# EAGLE design freeduino_V1.12 (EAGLE 4.16)
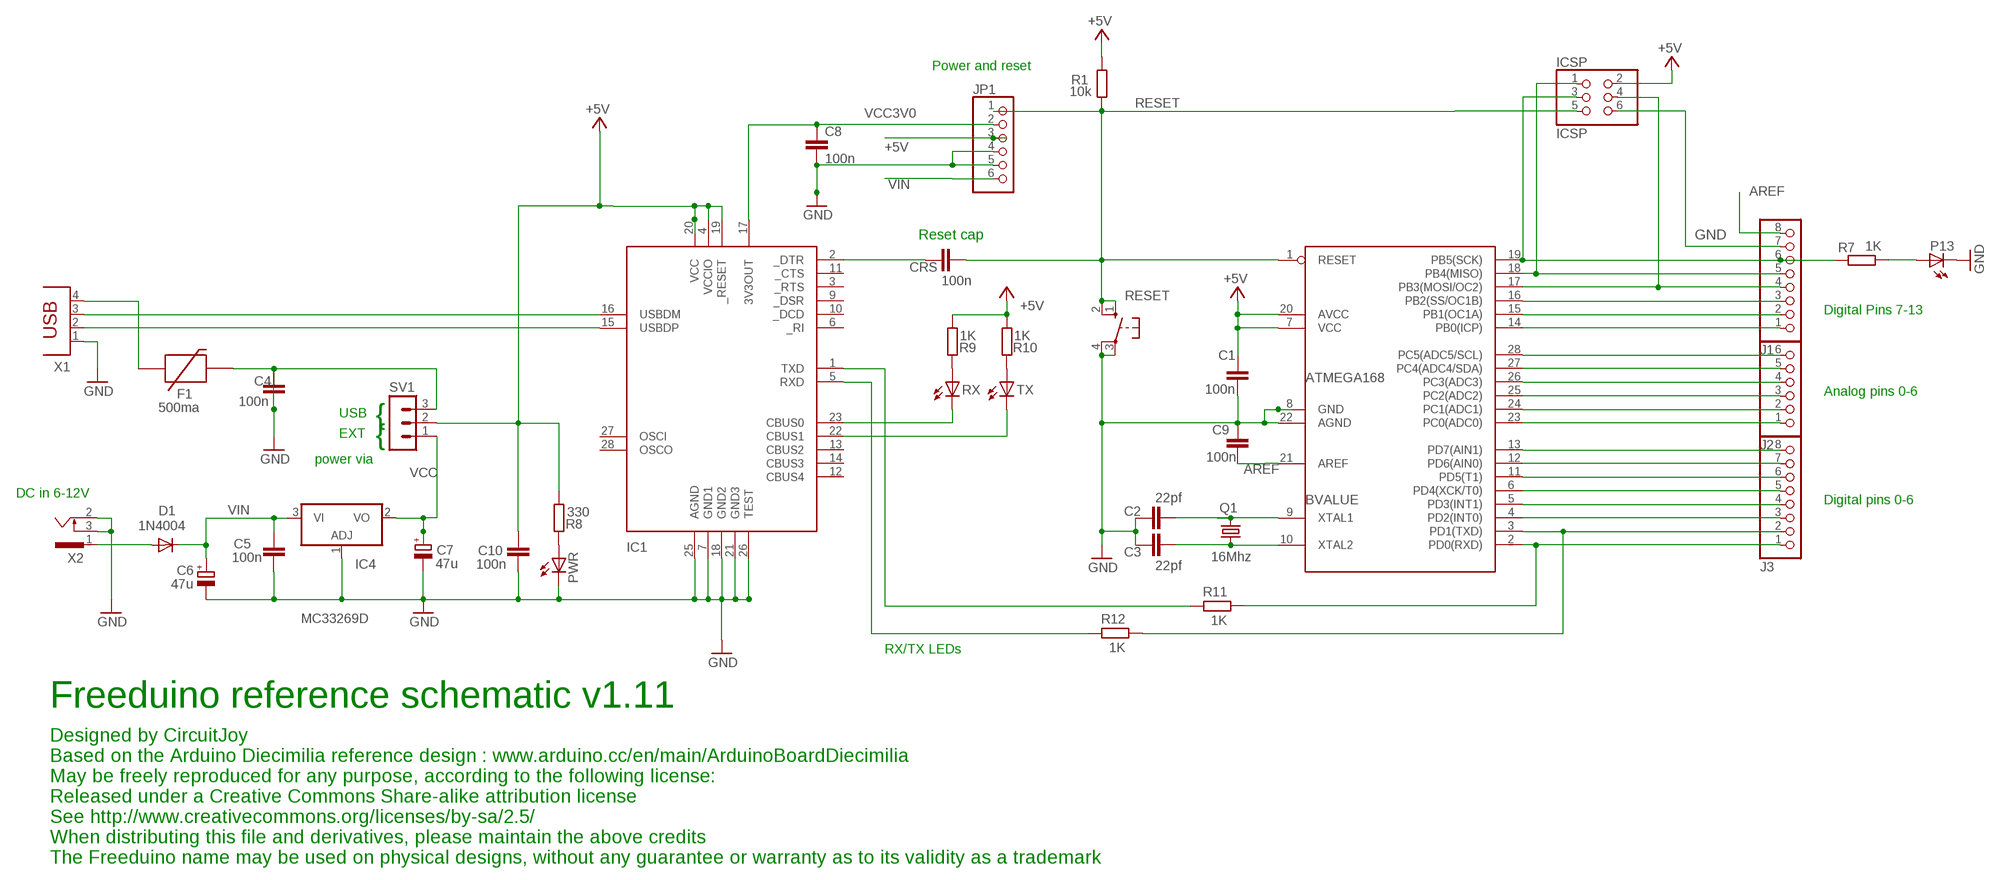
[diagram p0: schematic, sheet 1]

## Parts
BVALUE  ATMEGA168  MEGA8-P  [DIL28-3]
C1  100n  C-EUC0603  [C0603]
C2  22pf  C-EUC0603  [C0603]
C3  22pf  C-EUC0603  [C0603]
C4  100n  C-EUC0603  [C0603]
C5  100n  C-EUC0603  [C0603]
C6  47u  CPOL-EUD  [PANASONIC_D]
C7  47u  CPOL-EUD  [PANASONIC_D]
C8  100n  C-EUC0603  [C0603]
C9  100n  C-EUC0603  [C0603]
C10  100n  C-EUC0603  [C0603]
CRS  100n  C-EUC0603  [C0603]
D1  1N4004  DIODESMA  [SMA-DIODE]
F1  500ma  PTCPTH  [PTC]
IC1  FT232RL  FT232RL-PINNED  [SSOP28DB]
IC4  MC33269D  [DPACK]
ICSP  ICSP  PINHD-2X3  [2X03]
J1  PINHD-1X8  [1X08]
J2  PINHD-1X6  [1X06]
J3  PINHD-1X8  [1X08]
JP1  PINHD-1X6  [1X06]
P13  LEDCHIPLED_0603  [CHIPLED_0603]
PWR  LEDCHIPLED_0603  [CHIPLED_0603]
Q1  16Mhz  CRYSTALHC49U-V  [HC49U-V]
R1  10k  R-EU_R0603  [R0603]
R7  1K  R-EU_R0603  [R0603]
R8  330  R-EU_R0603  [R0603]
R9  1K  R-EU_R0603  [R0603]
R10  1K  R-EU_R0603  [R0603]
R11  1K  R-EU_R0603  [R0603]
R12  1K  R-EU_R0603  [R0603]
RESET  10-XX  [B3F-10XX]
RX  LEDCHIPLED_0603  [CHIPLED_0603]
SV1  MA03-1  [MA03-1]
TX  LEDCHIPLED_0603  [CHIPLED_0603]
X1  PN61729  [PN61729]
X2  SCD-014A  [SCD-014-A]

## Nets
+5V [power]: BVALUE.7(VCC) BVALUE.20(AVCC) C1.1 C10.2 IC1.4(VCCIO) IC1.19(_RESET) IC1.20(VCC) ICSP.2 JP1.3 R1.2 R8.1 R9.1 R10.1 SV1.2
AREF: BVALUE.21(AREF) C9.1 J1.8
GND [power]: BVALUE.8(GND) BVALUE.22(AGND) C1.2 C2.1 C3.1 C4.1 C4.2 C5.1 C6.- C7.- C8.2 C9.2 C10.1 F1.P$2 IC1.7(GND1) IC1.18(GND2) IC1.21(GND3) IC1.25(AGND) IC1.26(TEST) IC4.1(ADJ) ICSP.6 J1.7 JP1.4 JP1.5 P13.C PWR.C RESET.3(P) RESET.4(P1) SV1.3 X1.1 X2.2 X2.3
M8RXD: IC1.1(TXD) R11.1
M8TXD: IC1.5(RXD) R12.1
N$2: BVALUE.15(PB1(OC1A)) J1.2
N$3: PWR.A R8.2
N$5: IC1.23(CBUS0) RX.C
N$6: BVALUE.9(XTAL1) C2.2 Q1.2
N$8 [power]: D1.A X2.1
N$9: IC1.16(USBDM) X1.3
N$10: BVALUE.4(PD2(INT0)) J3.3
N$11: BVALUE.5(PD3(INT1)) J3.4
N$12: BVALUE.6(PD4(XCK/T0)) J3.5
N$13: BVALUE.11(PD5(T1)) J3.6
N$14: BVALUE.12(PD6(AIN0)) J3.7
N$15: BVALUE.13(PD7(AIN1)) J3.8
N$16: BVALUE.23(PC0(ADC0)) J2.1
N$17: BVALUE.24(PC1(ADC1)) J2.2
N$18: BVALUE.25(PC2(ADC2)) J2.3
N$19: BVALUE.26(PC3(ADC3)) J2.4
N$20: BVALUE.27(PC4(ADC4/SDA)) J2.5
N$21: BVALUE.28(PC5(ADC5/SCL)) J2.6
N$22: BVALUE.3(PD1(TXD)) J3.2 R12.2
N$23: BVALUE.16(PB2(SS/OC1B)) J1.3
N$24: IC1.15(USBDP) X1.2
N$26: BVALUE.18(PB4(MISO)) ICSP.1 J1.5
N$27: F1.P$1 X1.4
N$28: BVALUE.14(PB0(ICP)) J1.1
N$29: IC1.22(CBUS1) TX.C
N$31: BVALUE.10(XTAL2) C3.2 Q1.1
N$32: P13.A R7.1
N$34: R10.2 TX.A
N$36: R9.2 RX.A
N$37: CRS.1 IC1.2(_DTR)
N$43: BVALUE.17(PB3(MOSI/OC2)) ICSP.4 J1.4
N$44: BVALUE.2(PD0(RXD)) J3.1 R11.2
RESET: BVALUE.1(RESET) CRS.2 ICSP.5 JP1.1 R1.1 RESET.1(S) RESET.2(S1)
SCK: BVALUE.19(PB5(SCK)) ICSP.3 J1.6 R7.2
VCC: C7.+ IC4.2(VO) SV1.1
VCC3V0: C8.1 IC1.17(3V3OUT) JP1.2
VIN [power]: C5.2 C6.+ D1.C IC4.3(VI) JP1.6
Unconnected: IC1.3(_RTS) IC1.6(_RI) IC1.9(_DSR) IC1.10(_DCD) IC1.11(_CTS) IC1.12(CBUS4) IC1.13(CBUS2) IC1.14(CBUS3) IC1.27(OSCI) IC1.28(OSCO)

## Notes on the sheet
- Power and reset
- Reset cap
- Digital Pins 7-13
- Analog pins 0-6
- USB
- {
- EXT
- {
- power via
- DC in 6-12V
- Digital pins 0-6
- RX/TX LEDs
- Freeduino reference schematic v1.11
- Designed by CircuitJoy
- Based on the Arduino Diecimilia reference design : www.arduino.cc/en/main/ArduinoBoardDiecimilia
- May be freely reproduced for any purpose, according to the following license:
- Released under a Creative Commons Share-alike attribution license
- See http://www.creativecommons.org/licenses/by-sa/2.5/
- When distributing this file and derivatives, please maintain the above credits
- The Freeduino name may be used on physical designs, without any guarantee or warranty as to its validity as a trademark

## Library data of the parts
BVALUE = my-library:MEGA8-P: MICROCONTROLLER 8 Kbytes FLASH 1 kbytes SRAM 512 bytes EEPROM USART 4-channel 10 bit ADC 2-channel 8 bit ADC Source: avr.lbr
C1-C5 C8-C10 CRS = rcl:C-EU: CAPACITOR, European symbol
C6 C7 = rcl:CPOL-EU: POLARIZED CAPACITOR, European symbol
D1 = SparkFunEagle-6-6-07:DIODE: Diode These are standard reverse protection diodes and small signal diodes. SMA package can handle up to about 1A. SOD-323 can handle about 200mA. What the SOD-323 package when ordering, there are some mfgs out there that are 5-pin packages.
F1 = SparkFunEagle-6-6-07:PTC: Resettable Fuse PTC Resettable Fuse. Spark Fun Electronics SKU : COM-08357
IC1 = my-library:FT232RL-PINNED: USB UART FT232RL 4th Generation USB UART (USB <-> Serial) Controller. Spark Fun Electronics SKU : COM-00650
IC4 = linear:MC33269?*: Adjustable Output Low Dropout Voltage Regulator 800 mA Source: http://www.onsemi.com/pub/Collateral/MC33269-D.PDF
ICSP = pinhead:PINHD-2X3: PIN HEADER
J1 J3 = pinhead:PINHD-1X8: PIN HEADER
J2 JP1 = pinhead:PINHD-1X6: PIN HEADER
P13 PWR RX TX = led:LED: LED OSRAM: - CHIPLED LG R971, LG N971, LY N971, LG Q971, LY Q971, LO R971, LY R971 LH N974, LH R974 LS Q976, LO Q976, LY Q976 LO Q996 - Hyper CHIPLED LW Q18S LB Q993, LB Q99A, LB R99A - SideLED LS A670, LO A670, LY A670, LG A670, LP A670 LB A673, LV A673, LT A673, LW A673 LH A674 LY A675 LS A676, LA A676, LO A676, LY A676, LW A676 LS A679, LY A679, LG A679 - Hyper Micro SIDELED® LS Y876, LA Y876, LO Y876, LY Y876 LT Y87S - SmartLED LW L88C, LW L88S LB L89C, LB L89S, LG L890 LS L89K, LO L89K, LY L89K LS L896, LA L896, LO L896, LY L896 - TOPLED LS T670, LO T670, LY T670, LG T670, LP T670 LSG T670, LSP T670, LSY T670, LOP T670, LYG T670 LG T671, LOG T671, LSG T671 LB T673, LV T673, LT T673, LW T673 LH T674 LS T676, LA T676, LO T676, LY T676, LB T676, LH T676, LSB T676, LW T676 LB T67C, LV T67C, LT T67C, LS T67K, LO T67K, LY T67K, LW E67C LS E67B, LA E67B, LO E67B, LY E67B, LB E67C, LV E67C, LT E67C LW T67C LS T679, LY T679, LG T679 LS T770, LO T770, LY T770, LG T770, LP T770 LB T773, LV T773, LT T773, LW T773 LH T774 LS E675, LA E675, LY E675, LS T675 LS T776, LA T776, LO T776, LY T776, LB T776 LHGB T686 LT T68C, LB T68C - Hyper Mini TOPLED® LB M676 - Mini TOPLED Santana® LG M470 LS M47K, LO M47K, LY M47K Source: http://www.osram.convergy.de/
Q1 = crystal:CRYSTAL: CRYSTAL
R1 R7-R12 = rcl:R-EU_: RESISTOR, European symbol
RESET = switch-omron:10-XX: OMRON SWITCH
SV1 = con-lstb:MA03-1: PIN HEADER
X1 = con-berg:PN61729: BERG USB connector
X2 = con-shiua-chyuan:SCD-014A: Power Jack 2.5mm

## Net classes
1 power: width 0.61 mm

## Board
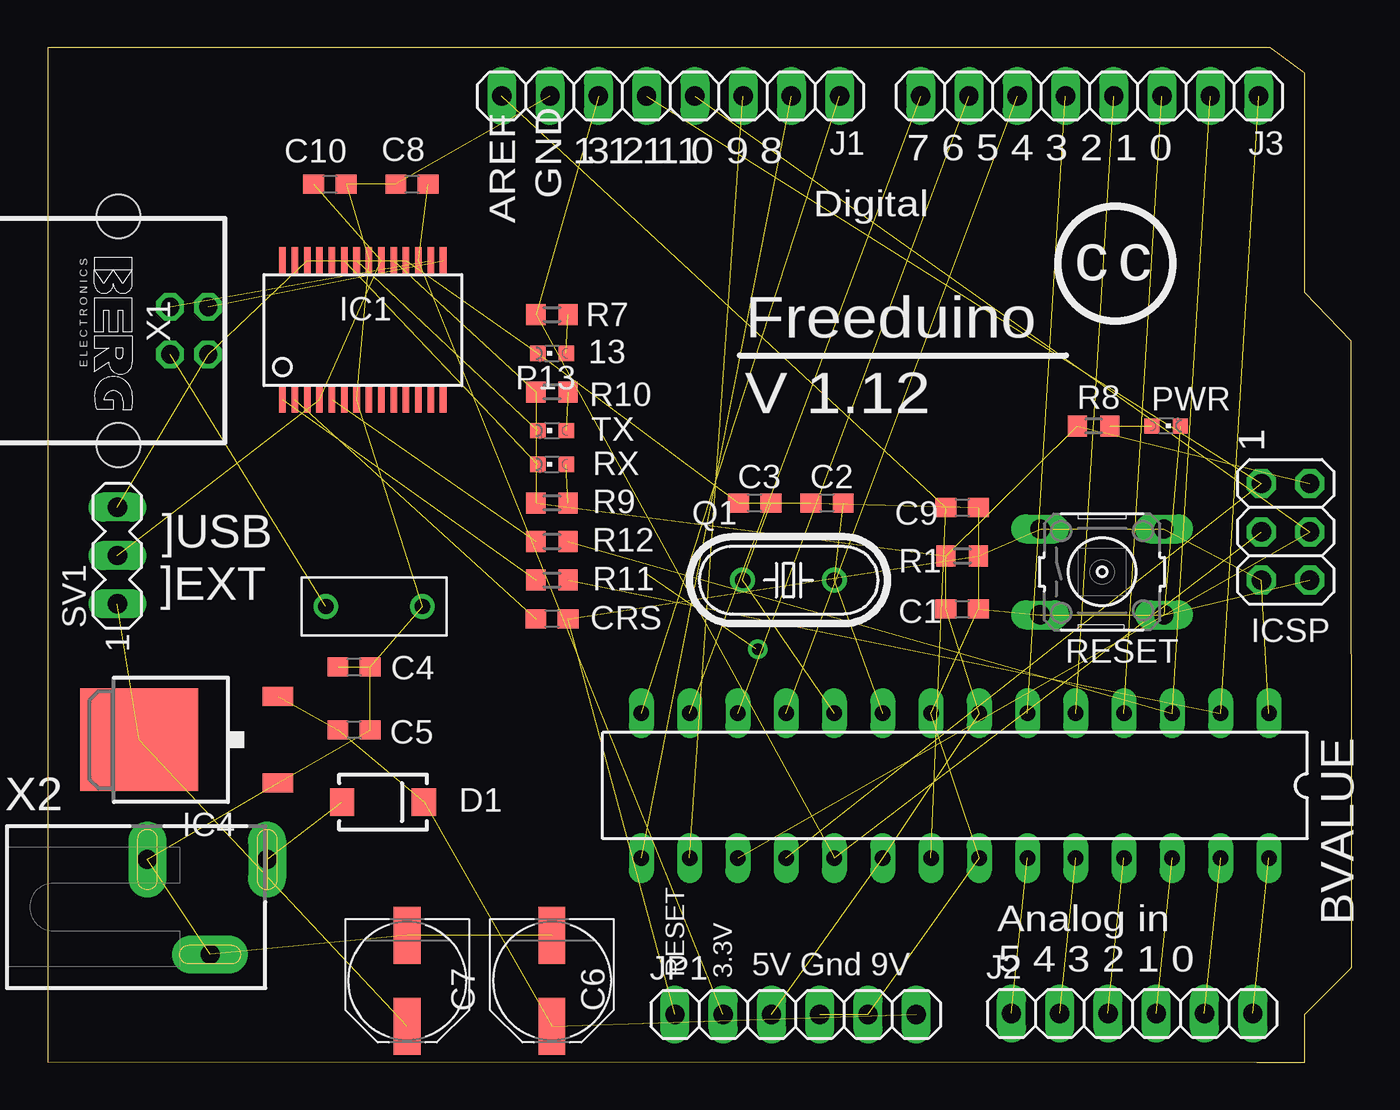
[diagram p1: board, top side]

Size 68.65 x 53.41 mm. Coordinates in mm from the lower left corner, seen from the top.
Outline: 0,53.41 0,0.01 63.63,0 66.16,0 66.17,0.03 66.17,2.51 68.65,5.01 68.62,37.96 66.17,40.5 66.17,52.06 64.34,53.4 0,53.41
Copper layers (1*16): Top 0.035mm / dielectric 1.5mm / Bottom 0.035mm
Design rules "default": minimum track width 10mil, minimum drill 24mil, track to track 8mil, track to pad 8mil, pad to pad 8mil, via to via 8mil, smd to smd 8mil, copper to edge 40mil, drill to drill 8mil, minimum pad ring 10mil, minimum via ring 8mil, stop-mask expansion 4mil, vias tented up to drill 0mil, thermal gap 10mil

### Footprints (pad centres in the part's own frame; a part is rotated, then mirrored left to right if it is on the bottom)
DIL28-3 = drill 0.813 long: 1 -16.51,-3.81; 2 -13.97,-3.81; 3 -11.43,-3.81; 4 -8.89,-3.81; 5 -6.35,-3.81; 6 -3.81,-3.81; 7 -1.27,-3.81; 8 1.27,-3.81; 9 3.81,-3.81; 10 6.35,-3.81; 11 8.89,-3.81; 12 11.43,-3.81; 13 13.97,-3.81; 14 16.51,-3.81; 15 16.51,3.81; 16 13.97,3.81; 17 11.43,3.81; 18 8.89,3.81; 19 6.35,3.81; 20 3.81,3.81; 21 1.27,3.81; 22 -1.27,3.81; 23 -3.81,3.81; 24 -6.35,3.81; 25 -8.89,3.81; 26 -11.43,3.81; 27 -13.97,3.81; 28 -16.51,3.81
C0603 = smd 1.1 x 1: 1 -0.85,0; 2 0.85,0
PANASONIC_D = smd 3 x 1.4: + 2.4,0; - -2.4,0
SMA-DIODE = smd 1.27 x 1.47: A -2.15,0; C 2.15,0
PTC = drill 0.8 round: P$1 -2.54,0; P$2 2.54,0
SSOP28DB = smd 0.348 x 1.397: 1 -4.225,-3.656; 2 -3.575,-3.656; 3 -2.925,-3.656; 4 -2.275,-3.656; 5 -1.625,-3.656; 6 -0.975,-3.656; 7 -0.325,-3.656; 8 0.325,-3.656; 9 0.975,-3.656; 10 1.625,-3.656; 11 2.275,-3.656; 12 2.925,-3.656; 13 3.575,-3.656; 14 4.225,-3.656; 15 4.225,3.656; 16 3.575,3.656; 17 2.925,3.656; 18 2.275,3.656; 19 1.625,3.656; 20 0.975,3.656; 21 0.325,3.656; 22 -0.325,3.656; 23 -0.975,3.656; 24 -1.625,3.656; 25 -2.275,3.656; 26 -2.925,3.656; 27 -3.575,3.656; 28 -4.225,3.656
DPACK = smd 1 x 1.6: 1 -2.28,-4.8; 3 2.28,-4.8 | smd 5.4 x 6.2: 2 0,2.5
2X03 = drill 1.016 octagon: 1 -2.54,-1.27; 2 -2.54,1.27; 3 0,-1.27; 4 0,1.27; 5 2.54,-1.27; 6 2.54,1.27
1X08 = drill 1.016 long: 1 -8.89,0; 2 -6.35,0; 3 -3.81,0; 4 -1.27,0; 5 1.27,0; 6 3.81,0; 7 6.35,0; 8 8.89,0
1X06 = drill 1.016 long: 1 -6.35,0; 2 -3.81,0; 3 -1.27,0; 4 1.27,0; 5 3.81,0; 6 6.35,0
CHIPLED_0603 = smd 0.8 x 0.8: A 0,-0.75; C 0,0.75
HC49U-V = drill 0.813 round: 1 -2.413,0; 2 2.413,0
R0603 = smd 1 x 1.1: 1 -0.85,0; 2 0.85,0
B3F-10XX = drill 1.016 long: 1 -3.251,2.261; 2 3.251,2.261; 3 -3.251,-2.261; 4 3.251,-2.261
MA03-1 = drill 1.016 long: 1 -2.54,0; 2 0,0; 3 2.54,0
PN61729 = drill 0.95 octagon: 1 1.25,4.71; 2 -1.25,4.71; 3 -1.25,2.71; 4 1.25,2.71 | hole 2.3: -6.02,0; 6.02,0
SCD-014-A = drill 1 pad 2 long: 1 -2.5,13.8; 2 -2.5,7.5; 3 2.5,10.8

### Placement (x,y rotation side)
BVALUE  47.76,14.56 180 top
C1  48.14,23.85 0 top
C2  41.02,29.44 0 top
C3  37.21,29.44 0 top
C4  16.13,20.8 180 top
C5  16.13,17.5 180 top
C6  26.55,4.29 270 top
C7  18.93,4.29 270 top
C8  19.18,46.2 180 top
C9  48.14,29.18 0 top
C10  14.86,46.2 180 top
CRS  26.55,23.34 0 top
D1  17.66,13.69 0 top
F1  17.19,23.99 0 top
IC1  16.59,38.54 0 top
IC4  7.33,16.97 90 top
ICSP  65.15,27.91 270 top
J1  32.79,50.85 180 top
J2  57.08,2.57 0 top
J3  54.84,50.85 180 top
JP1  39.37,2.51 0 top
P13  26.55,37.31 90 top
PWR  58.86,33.49 270 top
Q1  38.99,25.37 0 top
R1  48.14,26.64 180 top
R7  26.55,39.34 180 top
R8  55.05,33.49 0 top
R9  26.55,29.44 0 top
R10  26.55,35.28 0 top
R11  26.55,25.37 0 top
R12  26.55,27.41 0 top
RESET  55.49,25.81 0 top
RX  26.55,31.47 90 top
SV1  3.67,26.67 90 top
TX  26.55,33.25 90 top
U$3  [CC-LOGO]  57.08,42.63 0 top
X1  3.74,38.51 270 top
X2  -2.24,8.17 270 top

### Tracks (layer width: path | path; a pad name or v marks a point on that pad's centre or on a via)
+5V  (13 unrouted)
AREF  (2 unrouted)
GND  (31 unrouted)
M8RXD  (1 unrouted)
M8TXD  (1 unrouted)
N$2  (1 unrouted)
N$3  (1 unrouted)
N$5  (1 unrouted)
N$6  (2 unrouted)
N$8  (1 unrouted)
N$9  (1 unrouted)
N$10  (1 unrouted)
N$11  (1 unrouted)
N$12  (1 unrouted)
N$13  (1 unrouted)
N$14  (1 unrouted)
N$15  (1 unrouted)
N$16  (1 unrouted)
N$17  (1 unrouted)
N$18  (1 unrouted)
N$19  (1 unrouted)
N$20  (1 unrouted)
N$21  (1 unrouted)
N$22  (2 unrouted)
N$23  (1 unrouted)
N$24  (1 unrouted)
N$26  (2 unrouted)
N$27  (1 unrouted)
N$28  (1 unrouted)
N$29  (1 unrouted)
N$31  (2 unrouted)
N$32  (1 unrouted)
N$34  (1 unrouted)
N$36  (1 unrouted)
N$37  (1 unrouted)
N$38  (via drill 0.61)  (2 unrouted)
  other vias: 37.38,21.74
N$43  (2 unrouted)
N$44  (2 unrouted)
RESET  (6 unrouted)
SCK  (3 unrouted)
VCC  (2 unrouted)
VCC3V0  (2 unrouted)
VIN  (4 unrouted)

### Text on the board
tPlace: 13 | ]USB | ]EXT | RESET | 3.3V
tNames: 1 1 1 1 | 3 2 1 0 9 8 | 7 6 5 4 3 2 1 0 | GND | Digital | AREF | Freeduino | V 1.12 | 1 | Analog in | 5V Gnd 9V | 5 4 3 2 1 0